# EAGLE design SRD (EAGLE 6.3)

## Sheet 1 of 5: Power Supply
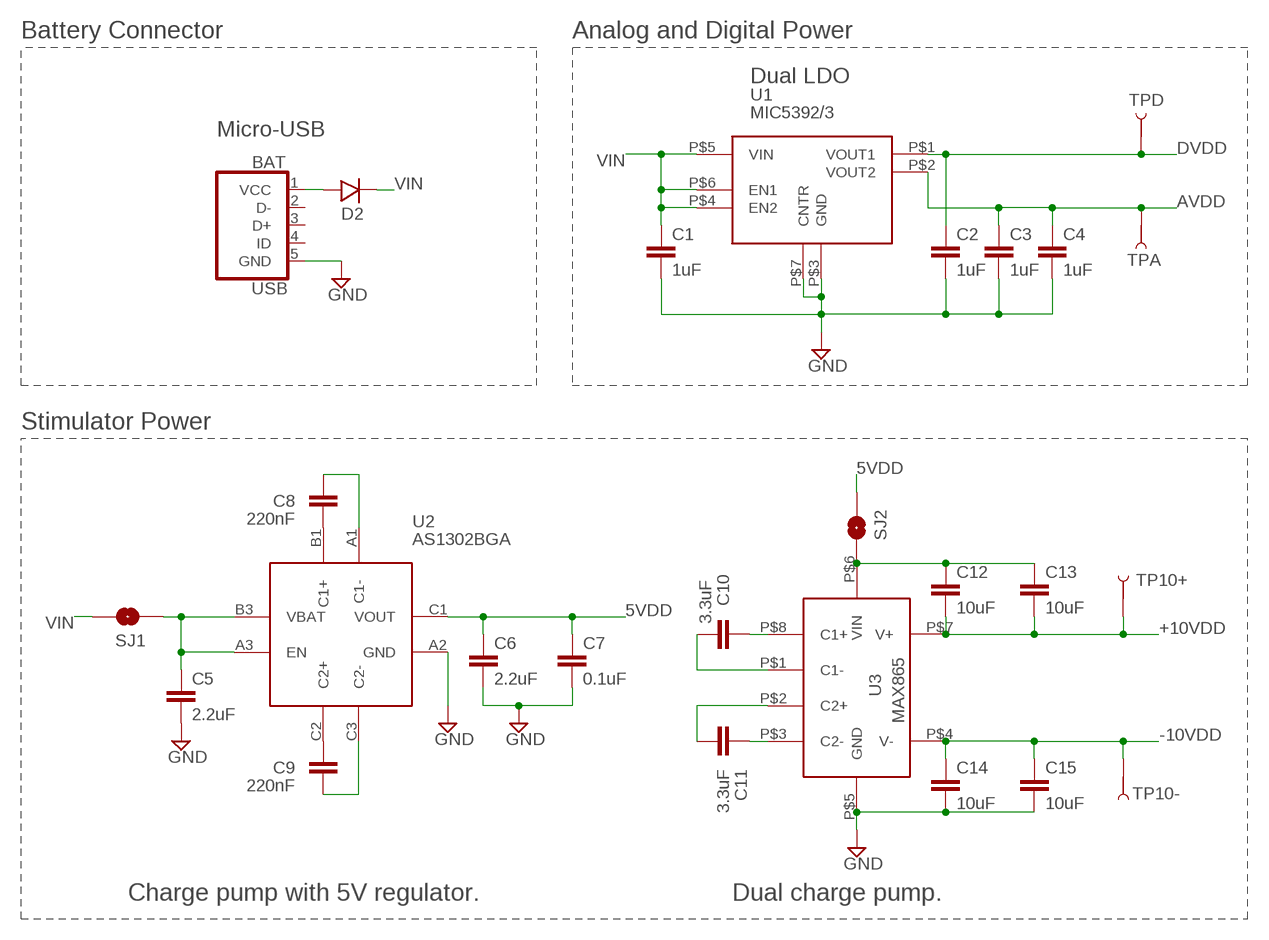
[diagram p0: schematic, sheet 1]

### Parts
BAT  USB  [USB-MICRO-B-TH]
C1  1uF  CC0603-N  [CAPC1608X90N]
C2  1uF  CC0603-N  [CAPC1608X90N]
C3  1uF  CC0603-N  [CAPC1608X90N]
C4  1uF  CC0603-N  [CAPC1608X90N]
C5  2.2uF  CC0603-N  [CAPC1608X90N]
C6  2.2uF  CC0603-N  [CAPC1608X90N]
C7  0.1uF  CC0603-N  [CAPC1608X90N]
C8  220nF  CC0402-N  [CAPC1005X55N]
C9  220nF  CC0402-N  [CAPC1005X55N]
C10  3.3uF  CC0805-N  [CAPC2012X100N]
C11  3.3uF  CC0805-N  [CAPC2012X100N]
C12  10uF  CC0805-N  [CAPC2012X100N]
C13  10uF  CC0805-N  [CAPC2012X100N]
C14  10uF  CC0805-N  [CAPC2012X100N]
C15  10uF  CC0805-N  [CAPC2012X100N]
D2  DIODE  [DO-216AA]
SJ1  SOLDERJUMPERNO  [SJ_2S-NO]
SJ2  SOLDERJUMPERNO  [SJ_2S-NO]
TP10+  TEST-POINT  [PAD1MMX1MM]
TP10-  TEST-POINT  [PAD1MMX1MM]
TPA  TEST-POINT  [PAD1MMX1MM]
TPD  TEST-POINT  [PAD1MMX1MM]
U1  MIC5392/3  [THIN_DFN]
U2  AS1302BGA  [BGA9C40P3X3_121X121X63B27N]
U3  MAX865  [UMAX8]

### Nets
5VDD: C6.1 C7.1 SJ2.1 U2.C1(VOUT)
+10VDD: C12.2 C13.2 TP10+.P$1 U3.P$7(V+) ; also sheet 5
-10VDD: C14.1 C15.1 TP10-.P$1 U3.P$4(V-) ; also sheet 5
AVDD: C3.1 C4.1 TPA.P$1 U1.P$2(VOUT2) ; also sheet 4
DVDD: C2.1 TPD.P$1 U1.P$1(VOUT1) ; also sheet 2,3,5
GND: BAT.5(GND) C1.2 C2.2 C3.2 C4.2 C5.2 C6.2 C7.2 C14.2 C15.2 U1.P$3(GND) U1.P$7(CNTR) U2.A2(GND) U3.P$5(GND) ; also sheet 2,3,4,5
N$4: C5.1 SJ1.1 U2.A3(EN) U2.B3(VBAT)
N$13: C12.1 C13.1 SJ2.2 U3.P$6(VIN)
N$33: C8.1 U2.A1(C1-)
N$36: C9.2 U2.C3(C2-)
N$42: C11.1 U3.P$3(C2-)
N$46: C11.2 U3.P$2(C2+)
N$47: C10.1 U3.P$8(C1+)
N$48: C10.2 U3.P$1(C1-)
N$49: C8.2 U2.B1(C1+)
N$50: C9.1 U2.C2(C2+)
VBAT: BAT.1(VCC) D2.A
VIN: C1.1 D2.C SJ1.2 U1.P$4(EN2) U1.P$5(VIN) U1.P$6(EN1)
Unconnected: BAT.2(D-) BAT.3(D+) BAT.4(ID)

### Notes on the sheet
- Battery Connector | Analog and Digital Power
- Dual LDO
- Micro-USB
- Stimulator Power
- Charge pump with 5V regulator. | Dual charge pump.

## Sheet 2 of 5: Main
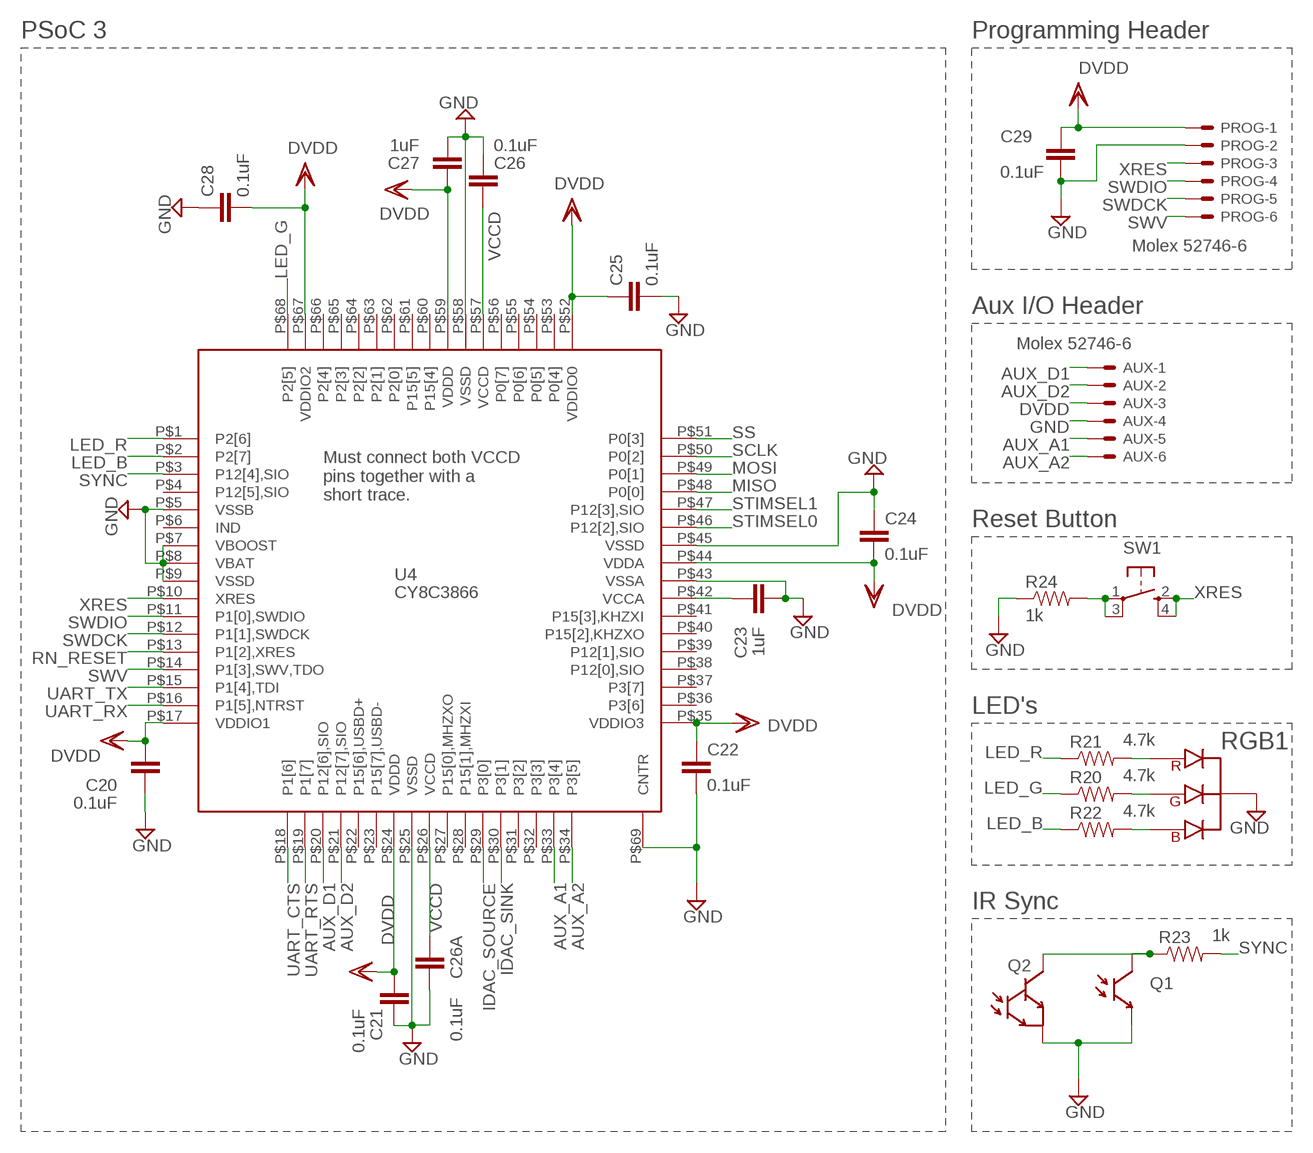
[diagram p1: schematic, sheet 2]

### Parts
AUX  52746-6  [52746-6]
C20  0.1uF  CC0402-N  [CAPC1005X55N]
C21  0.1uF  CC0402-N  [CAPC1005X55N]
C22  0.1uF  CC0402-N  [CAPC1005X55N]
C23  1uF  CC0402-N  [CAPC1005X55N]
C24  0.1uF  CC0402-N  [CAPC1005X55N]
C25  0.1uF  CC0402-N  [CAPC1005X55N]
C26  0.1uF  CC0402-N  [CAPC1005X55N]
C26A  0.1uF  CC0402-N  [CAPC1005X55N]
C27  1uF  CC0402-N  [CAPC1005X55N]
C28  0.1uF  CC0402-N  [CAPC1005X55N]
C29  0.1uF  CC0402-N  [CAPC1005X55N]
PROG  52746-6  [52746-6]
Q1  PHOTOTRANSISTOR  [MTD8000M3B-T]
Q2  PHOTOTRANSISTOR_D  [OP501]
R20  4.7k  RR0402-N  [RESC1005X35N]
R21  4.7k  RR0402-N  [RESC1005X35N]
R22  4.7k  RR0402-N  [RESC1005X35N]
R23  1k  RR0402-N  [RESC1005X35N]
R24  1k  RR0402-N  [RESC1005X35N]
RGB1  LED_RGB  [LED_RGB]
SW1  SPST_TACT-KMR2  [KMR2]
U4  CY8C3866  [QFN68_8MM_0.4PITCH]

### Nets
AUX_A1: AUX.5 U4.P$33(P3[4])
AUX_A2: AUX.6 U4.P$34(P3[5])
AUX_D1: AUX.1 U4.P$20(P12[6],SIO)
AUX_D2: AUX.2 U4.P$21(P12[7],SIO)
DVDD: AUX.3 C20.1 C21.1 C22.1 C24.2 C25.1 C27.1 C28.2 C29.1 PROG.1 U4.P$17(VDDIO1) U4.P$24(VDDD) U4.P$35(VDDIO3) U4.P$44(VDDA) U4.P$52(VDDIO0) U4.P$59(VDDD) U4.P$67(VDDIO2) ; supply symbol labelled VDD ; also sheet 1,3,5
GND: AUX.4 C20.2 C21.2 C22.2 C23.2 C24.1 C25.2 C26.2 C26A.1 C27.2 C28.1 C29.2 PROG.2 Q1.E Q2.E R24.1 RGB1.P$1(COM) U4.P$5(VSSB) U4.P$7(VBOOST) U4.P$8(VBAT) U4.P$9(VSSD) U4.P$25(VSSD) U4.P$43(VSSA) U4.P$45(VSSD) U4.P$58(VSSD) U4.P$69(CNTR) ; also sheet 1,3,4,5
IDAC_SINK: U4.P$30(P3[1]) ; also sheet 5
IDAC_SOURCE: U4.P$29(P3[0]) ; also sheet 5
LED_B: R22.1 U4.P$2(P2[7])
LED_G: R20.1 U4.P$68(P2[5])
LED_R: R21.1 U4.P$1(P2[6])
MISO: U4.P$48(P0[0]) ; also sheet 4
MOSI: U4.P$49(P0[1]) ; also sheet 4
N$3: R21.2 RGB1.P$2(R)
N$5: R20.2 RGB1.P$3(G)
N$7: R22.2 RGB1.P$4(B)
N$10: Q1.C Q2.C R23.1
N$12: R24.2 SW1.1(P) SW1.3(P1)
N$30: C23.1 U4.P$42(VCCA)
RN_RESET: U4.P$13(P1[2],XRES) ; also sheet 3
SCLK: U4.P$50(P0[2]) ; also sheet 4
SS: U4.P$51(P0[3]) ; also sheet 4
STIMSEL0: U4.P$46(P12[2],SIO) ; also sheet 5
STIMSEL1: U4.P$47(P12[3],SIO) ; also sheet 5
SWDCK: PROG.5 U4.P$12(P1[1],SWDCK)
SWDIO: PROG.4 U4.P$11(P1[0],SWDIO)
SWV: PROG.6 U4.P$14(P1[3],SWV,TDO)
SYNC: R23.2 U4.P$3(P12[4],SIO)
UART_CTS: U4.P$18(P1[6]) ; also sheet 3
UART_RTS: U4.P$19(P1[7]) ; also sheet 3
UART_RX: U4.P$16(P1[5],NTRST) ; also sheet 3
UART_TX: U4.P$15(P1[4],TDI) ; also sheet 3
VCCD: C26.1 C26A.2 U4.P$26(VCCD) U4.P$57(VCCD)
XRES: PROG.3 SW1.2(S) SW1.4(S1) U4.P$10(XRES)
Unconnected: U4.P$4(P12[5],SIO) U4.P$6(IND) U4.P$22(P15[6],USBD+) U4.P$23(P15[7],USBD-) U4.P$27(P15[0],MHZXO) U4.P$28(P15[1],MHZXI) U4.P$31(P3[2]) U4.P$32(P3[3]) U4.P$36(P3[6]) U4.P$37(P3[7]) U4.P$38(P12[0],SIO) U4.P$39(P12[1],SIO) U4.P$40(P15[2],KHZXO) U4.P$41(P15[3],KHZXI) U4.P$53(P0[4]) U4.P$54(P0[5]) U4.P$55(P0[6]) U4.P$56(P0[7]) U4.P$60(P15[4]) U4.P$61(P15[5]) U4.P$62(P2[0]) U4.P$63(P2[1]) U4.P$64(P2[2]) U4.P$65(P2[3]) U4.P$66(P2[4])

### Notes on the sheet
- PSoC 3 | Programming Header
- Molex 52746-6
- Aux I/O Header
- Molex 52746-6
- Must connect both VCCD
  pins together with a
  short trace.
- Reset Button
- LED's
- IR Sync

## Sheet 3 of 5: Bluetooth
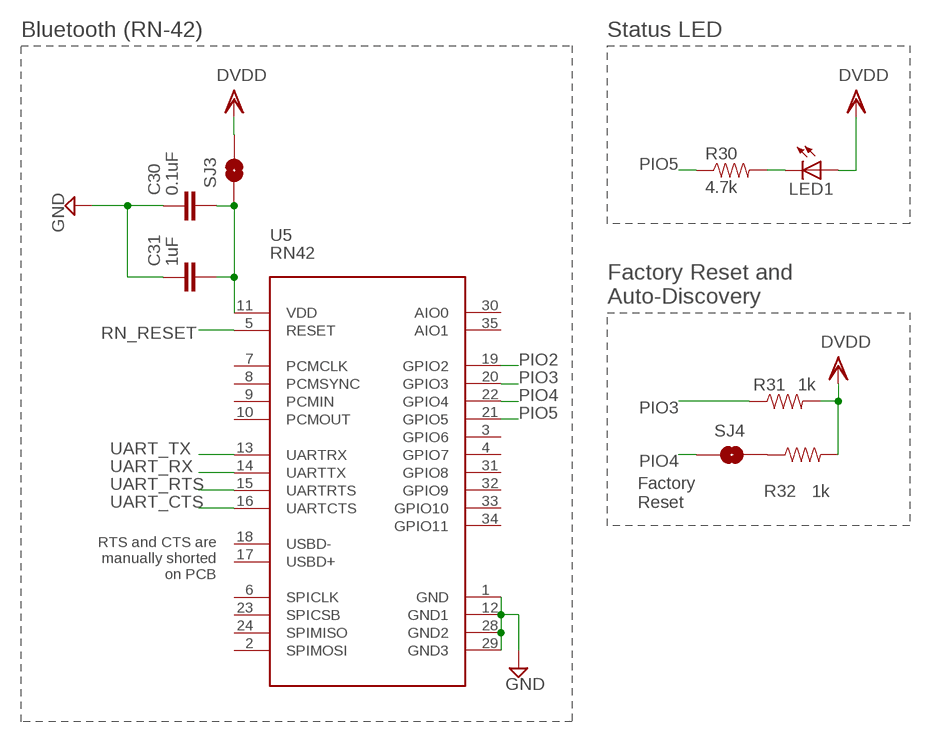
[diagram p2: schematic, sheet 3]

### Parts
C30  0.1uF  CC0603-N  [CAPC1608X90N]
C31  1uF  CC0805-N  [CAPC2012X100N]
LED1  LED  [CHIPLED_0603]
R30  4.7k  RR0402-N  [RESC1005X35N]
R31  1k  RR0402-N  [RESC1005X35N]
R32  1k  RR0402-N  [RESC1005X35N]
SJ3  SOLDERJUMPERNO  [SJ_2S-NO]
SJ4  SOLDERJUMPERNO  [SJ_2S-NO]
U5  RN42  [RN42]

### Nets
DVDD: LED1.A R31.2 R32.2 SJ3.2 ; supply symbol labelled VDD ; also sheet 1,2,5
GND: C30.1 C31.1 U5.1(GND) U5.12(GND1) U5.28(GND2) U5.29(GND3) ; also sheet 1,2,4,5
N$8: LED1.C R30.2
N$9: C30.2 C31.2 SJ3.1 U5.11(VDD)
N$16: R32.1 SJ4.2
PIO2: U5.19(GPIO2)
PIO3: R31.1 U5.20(GPIO3)
PIO4: SJ4.1 U5.22(GPIO4)
PIO5: R30.1 U5.21(GPIO5)
RN_RESET: U5.5(RESET) ; also sheet 2
UART_CTS: U5.16(UARTCTS) ; also sheet 2
UART_RTS: U5.15(UARTRTS) ; also sheet 2
UART_RX: U5.14(UARTTX) ; also sheet 2
UART_TX: U5.13(UARTRX) ; also sheet 2
Unconnected: U5.2(SPIMOSI) U5.3(GPIO6) U5.4(GPIO7) U5.6(SPICLK) U5.7(PCMCLK) U5.8(PCMSYNC) U5.9(PCMIN) U5.10(PCMOUT) U5.17(USBD+) U5.18(USBD-) U5.23(SPICSB) U5.24(SPIMISO) U5.30(AIO0) U5.31(GPIO8) U5.32(GPIO9) U5.33(GPIO10) U5.34(GPIO11) U5.35(AIO1)

### Notes on the sheet
- Bluetooth (RN-42) | Status LED
- Factory Reset and 
  Auto-Discovery
- Factory
  Reset
- RTS and CTS are
  manually shorted
  on PCB

## Sheet 4 of 5: ADC
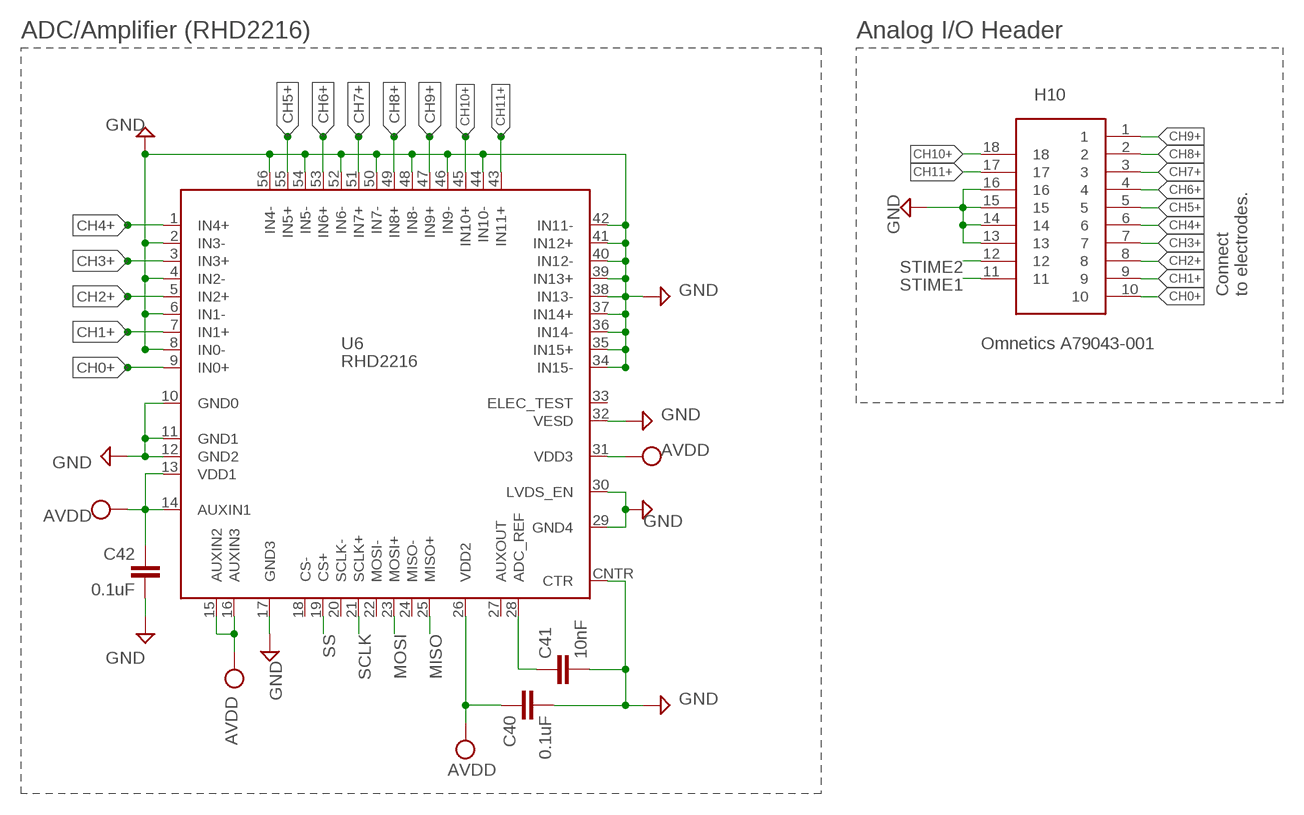
[diagram p3: schematic, sheet 4]

### Parts
C40  0.1uF  CC0402-N  [CAPC1005X55N]
C41  10nF  CC0402-N  [CAPC1005X55N]
C42  0.1uF  CC0402-N  [CAPC1005X55N]
H10  A79043-001  [OMNETCS-18PIN-SMD]
U6  RHD2216  [RHD2000]

### Nets
AVDD: C40.1 C42.1 U6.13(VDD1) U6.14(AUXIN1) U6.15(AUXIN2) U6.16(AUXIN3) U6.26(VDD2) U6.31(VDD3) ; supply symbol labelled VDD ; also sheet 1
CH0+: H10.10 U6.9(IN0+)
CH1+: H10.9 U6.7(IN1+)
CH2+: H10.8 U6.5(IN2+)
CH3+: H10.7 U6.3(IN3+)
CH4+: H10.6 U6.1(IN4+)
CH5+: H10.5 U6.55(IN5+)
CH6+: H10.4 U6.53(IN6+)
CH7+: H10.3 U6.51(IN7+)
CH8+: H10.2 U6.49(IN8+)
CH9+: H10.1 U6.47(IN9+)
CH10+: H10.18 U6.45(IN10+)
CH11+: H10.17 U6.43(IN11+)
GND: C40.2 C41.2 C42.2 H10.13 H10.14 H10.15 H10.16 U6.2(IN3-) U6.4(IN2-) U6.6(IN1-) U6.8(IN0-) U6.10(GND0) U6.11(GND1) U6.12(GND2) U6.17(GND3) U6.29(GND4) U6.30(LVDS_EN) U6.32(VESD) U6.34(IN15-) U6.35(IN15+) U6.36(IN14-) U6.37(IN14+) U6.38(IN13-) U6.39(IN13+) U6.40(IN12-) U6.41(IN12+) U6.42(IN11-) U6.44(IN10-) U6.46(IN9-) U6.48(IN8-) U6.50(IN7-) U6.52(IN6-) U6.54(IN5-) U6.56(IN4-) U6.CNTR(CTR) ; also sheet 1,2,3,5
MISO: U6.25(MISO+) ; also sheet 2
MOSI: U6.23(MOSI+) ; also sheet 2
N$2: C41.1 U6.28(ADC_REF)
SCLK: U6.21(SCLK+) ; also sheet 2
SS: U6.19(CS+) ; also sheet 2
STIME1: H10.11 ; also sheet 5
STIME2: H10.12 ; also sheet 5
Unconnected: U6.18(CS-) U6.20(SCLK-) U6.22(MOSI-) U6.24(MISO-) U6.27(AUXOUT) U6.33(ELEC_TEST)

### Notes on the sheet
- ADC/Amplifier (RHD2216) | Analog I/O Header
- Connect
  to electrodes.
- Omnetics A79043-001

## Sheet 5 of 5: Stimulator
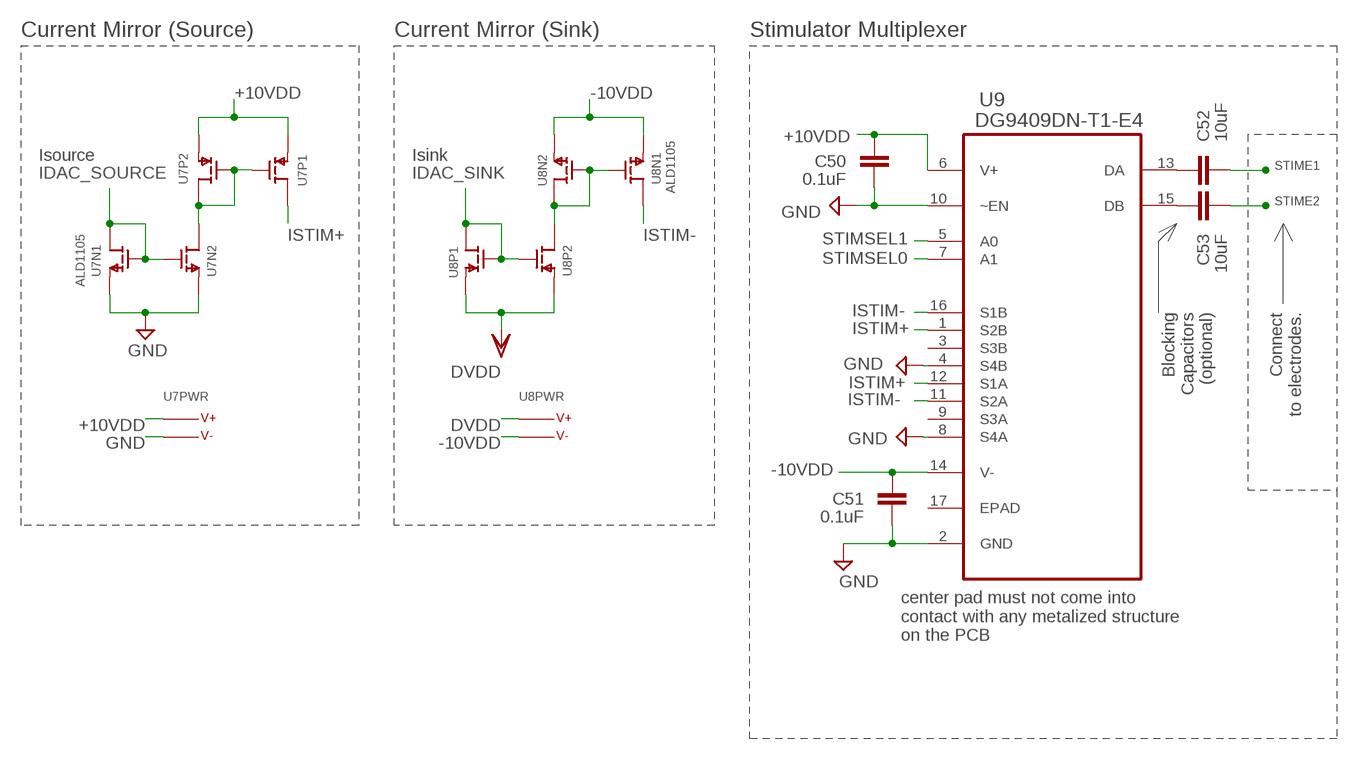
[diagram p4: schematic, sheet 5]

### Parts
C50  0.1uF  CC0603-N  [CAPC1608X90N]
C51  0.1uF  CC0603-N  [CAPC1608X90N]
C52  10uF  CC0805-N  [CAPC2012X100N]
C53  10uF  CC0805-N  [CAPC2012X100N]
U7  ALD1105  [SO14MIN]
U8  ALD1105  [SO14MIN]
U9  DG9409DN-T1-E4  [QFN65P400X400X100-17N]

### Nets
+10VDD: C50.1 U7.7(P1:S) U7.8(P2:S) U7.11(PWR:V+) U9.6(V+) ; also sheet 1
-10VDD: C51.1 U8.3(N1:S) U8.4(PWR:V-) U8.12(N2:S) U9.14(V-) ; also sheet 1
DVDD: U8.7(P1:S) U8.8(P2:S) U8.11(PWR:V+) ; supply symbol labelled VDD ; also sheet 1,2,3
GND: C50.2 C51.2 U7.3(N1:S) U7.4(PWR:V-) U7.12(N2:S) U9.2(GND) U9.4(S4B) U9.8(S4A) U9.10(~EN) ; also sheet 1,2,3,4
IDAC_SINK: U8.5(P1:D) U8.6(P1:G) U8.9(P2:G) ; also sheet 2
IDAC_SOURCE: U7.1(N1:D) U7.2(N1:G) U7.13(N2:G) ; also sheet 2
ISTIM+: U7.5(P1:D) U9.1(S2B) U9.12(S1A)
ISTIM-: U8.1(N1:D) U9.11(S2A) U9.16(S1B)
N$6: C52.1 U9.13(DA)
N$11: U7.6(P1:G) U7.9(P2:G) U7.10(P2:D) U7.14(N2:D)
N$17: C53.1 U9.15(DB)
N$31: U8.2(N1:G) U8.10(P2:D) U8.13(N2:G) U8.14(N2:D)
STIME1: C52.2 ; also sheet 4
STIME2: C53.2 ; also sheet 4
STIMSEL0: U9.7(A1) ; also sheet 2
STIMSEL1: U9.5(A0) ; also sheet 2
Unconnected: U9.3(S3B) U9.9(S3A) U9.17(EPAD)

### Notes on the sheet
- Current Mirror (Source) | Current Mirror (Sink) | Stimulator Multiplexer
- Isource | Isink
- Blocking
  Capacitors
  (optional)
- Connect
  to electrodes.
- center pad must not come into
  contact with any metalized structure
  on the PCB

## Library data of the parts
AUX PROG = con-molex:52746-6: FPC Connector ZIF for SMT 0.5mm Source: http://www.farnell.com/datasheets/73044.pdf [DWG. NO. (Sheet 1 OF 2) SD-52746-**17]; OC_FARNELL: unknown; OC_NEWARK: unknown
BAT = Ramshur:USB: USB Micro-B Plug Comes in a variety of packages. Check out Hirose's ZX-x0 line: http://www.hirose.co.jp/cataloge_hp/e24200011.pdf
C1-C15 C20-C26 C26A C27-C31 C40-C42 C50-C53 = Ramshur:C: Capacitor (english/metric) cermaic capacitor nominal landpattern (N).
D2 = Ramshur:DIODE: Diode
H10 = Ramshur:A79043-001: Omnetics 18 Position Dual Row Female Nano-Miniature (.025"/.64mm) Connector. Featuring 2 Guide Posts Holes and Vertical Surface Mount Tails.
LED1 = Ramshur:LED: LED OSRAM: - CHIPLED LG R971, LG N971, LY N971, LG Q971, LY Q971, LO R971, LY R971 LH N974, LH R974 LS Q976, LO Q976, LY Q976 LO Q996 - Hyper CHIPLED LW Q18S LB Q993, LB Q99A, LB R99A - SideLED LS A670, LO A670, LY A670, LG A670, LP A670 LB A673, LV A673, LT A673, LW A673 LH A674 LY A675 LS A676, LA A676, LO A676, LY A676, LW A676 LS A679, LY A679, LG A679 - Hyper Micro SIDELED® LS Y876, LA Y876, LO Y876, LY Y876 LT Y87S - SmartLED LW L88C, LW L88S LB L89C, LB L89S, LG L890 LS L89K, LO L89K, LY L89K LS L896, LA L896, LO L896, LY L896 - TOPLED LS T670, LO T670, LY T670, LG T670, LP T670 LSG T670, LSP T670, LSY T670, LOP T670, LYG T670 LG T671, LOG T671, LSG T671 LB T673, LV T673, LT T673, LW T673 LH T674 LS T676, LA T676, LO T676, LY T676, LB T676, LH T676, LSB T676, LW T676 LB T67C, LV T67C, LT T67C, LS T67K, LO T67K, LY T67K, LW E67C LS E67B, LA E67B, LO E67B, LY E67B, LB E67C, LV E67C, LT E67C LW T67C LS T679, LY T679, LG T679 LS T770, LO T770, LY T770, LG T770, LP T770 LB T773, LV T773, LT T773, LW T773 LH T774 LS E675, LA E675, LY E675, LS T675 LS T776, LA T776, LO T776, LY T776, LB T776 LHGB T686 LT T68C, LB T68C - Hyper Mini TOPLED® LB M676 - Mini TOPLED Santana® LG M470 LS M47K, LO M47K, LY M47K Source: http://www.osram.convergy.de/
Q1 = Ramshur:PHOTOTRANSISTOR: phototransistor
Q2 = Ramshur:PHOTOTRANSISTOR_D
R20-R24 R30-R32 = Ramshur:R: Resistor Basic schematic elements and footprints for 0603, 1206, and PTH resistors.
RGB1 = Ramshur:LED_RGB: Kignbright APTF1616SEJ3ZGGVBDC
SJ1-SJ4 = Ramshur:SOLDERJUMPER: Solder Jumper Standard SMD solder jumper. Used to automate production. Two varients : Normally Open and Normally Closed are the same, but have different paste layers. NC will have a large amount of paste and should jumper during reflow.
SW1 = _adafruit:SPST_TACT: SMT 6mm switch, EVQQ2 series http://www.ladyada.net/library/eagle
TP10+ TP10- TPA TPD = Ramshur:TEST-POINT: Bare copper test points for troubleshooting or ICT
U1 = Ramshur:MIC5392/3: Micrel High-Performance Dual 150mA LDO
U2 = Ramshur:AS1302
U3 = _ramshur:MAX865
U4 = Ramshur:CY8C3866
U5 = Ramshur:RN42: Microchip (Roving Networks) RN42 Bluetooth module with antena.
U6 = Ramshur:RHD2216
U7 U8 = Ramshur:ALD1105
U9 = DG9409:DG9409DN-T1-E4: Analog Multiplexers; MPN: DG9409DN-T1-E4; OC_FARNELL: -; OC_NEWARK: 65K2483; PACKAGE: QFN-16; SUPPLIER: VISHAY SILICONIX

## Board
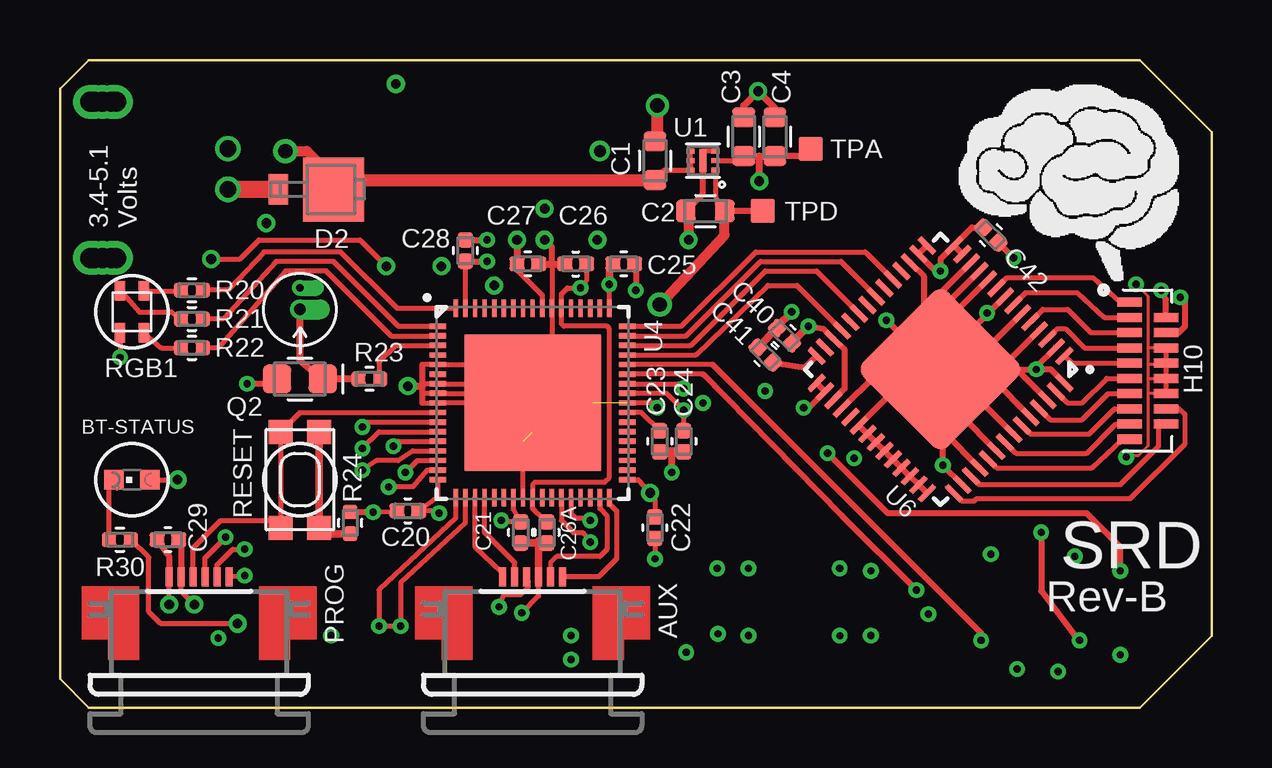
[diagram p5: board, top side]
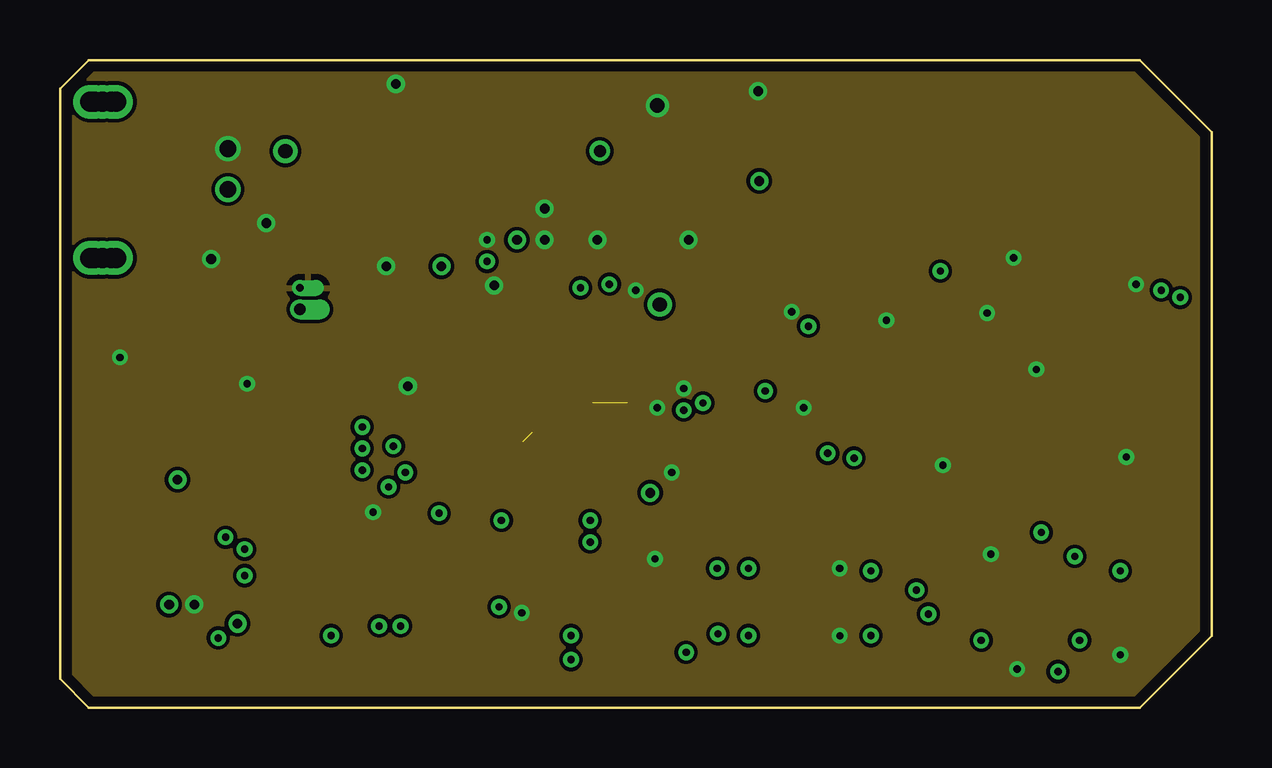
[diagram p6: board, inner layer Route2]
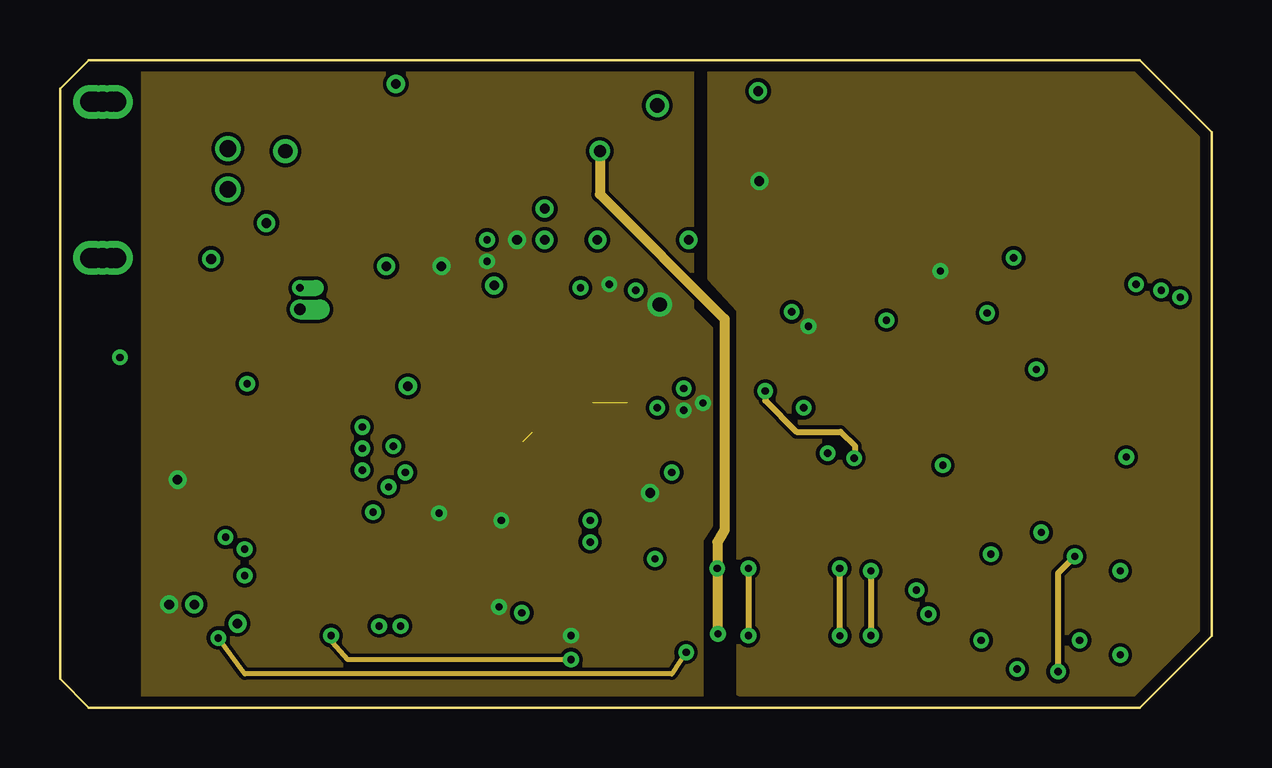
[diagram p7: board, inner layer Route15]
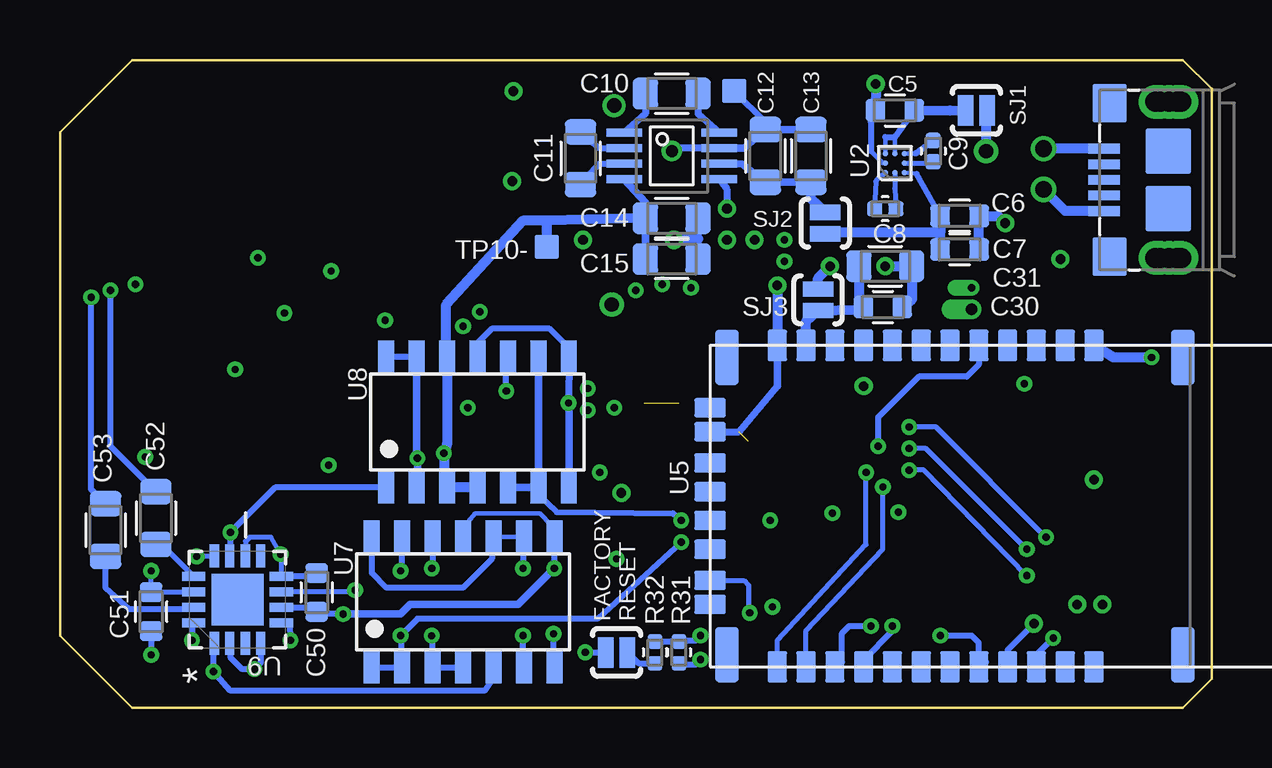
[diagram p8: board, bottom side, seen from below]

Size 48 x 27 mm. Coordinates in mm from the lower left corner, seen from the top.
Outline: 1.2,0 45,0 48,3 48,24 45,27 1.2,27 0,25.8 0,1.2 1.2,0
Copper layers ((1*2)+(15*16)): Top 0.0356mm / dielectric 1.5011mm / Route2 0.0356mm / dielectric 0.1499mm / Route15 0.0356mm / dielectric 0.2007mm / Bottom 0.0356mm
Design rules "LaenPCBOrder_johnmod": minimum track width 5mil, minimum drill 10mil, track to track 6mil, track to pad 6mil, pad to pad 6mil, via to via 6mil, smd to smd 6mil, copper to edge 17mil, drill to drill 6mil, minimum pad ring 7mil, minimum via ring 7mil, stop-mask expansion 0.04mm, vias tented up to drill 0.8mm, thermal gap 10mil

### Footprints (pad centres in the part's own frame; a part is rotated, then mirrored left to right if it is on the bottom)
52746-6 = smd 0.3 x 0.8: 1 -1.25,2.35; 2 -0.75,2.35; 3 -0.25,2.35; 4 0.25,2.35; 5 0.75,2.35; 6 1.25,2.35
USB-MICRO-B-TH = smd 0.4 x 1.35: 1 -1.3,2.675; 2 -0.65,2.675; 3 0,2.675; 4 0.65,2.675; 5 1.3,2.675 | drill 0.84 pad 1.4: P$1 -3.255,-0.36; P$2 -3.255,-0.03; P$3 -3.255,0.54; P$4 -3.255,-0.54; P$5 -3.255,0.34; P$6 3.255,0.54; P$7 3.255,-0.54; P$8 3.255,-0.36; P$9 3.255,-0.03; P$10 3.255,0.34 | smd 1.6 x 1.4: PAD1 -3.2,2.45; PAD2 3.2,2.45 | smd 1.9 x 1.9: TH1 -1.2,0; TH2 1.2,0
CAPC1608X90N = smd 0.81 x 0.93: 1 -0.81,0; 2 0.81,0
CAPC1005X55N = smd 0.64 x 0.63: 1 -0.445,0; 2 0.445,0
CAPC2012X100N = smd 1.05 x 1.3: 1 -1.1,0; 2 1.1,0
DO-216AA = smd 0.8 x 1.27: A 0.7,0 | smd 2.54 x 2.67: C -1.6,0
OMNETCS-18PIN-SMD = smd 1.016 x 0.381: 1 1.524,5.715; 2 1.524,5.08; 3 1.524,4.445; 4 1.524,3.81; 5 1.524,3.175; 6 1.524,2.54; 7 1.524,1.905; 8 1.524,1.27; 9 1.524,0.635; 10 1.524,0; 11 0,0.635; 12 0,1.27; 13 0,1.905; 14 0,2.54; 15 0,3.175; 16 0,3.81; 17 0,4.445; 18 0,5.08
CHIPLED_0603 = smd 0.8 x 0.8: A 0,-0.75; C 0,0.75
MTD8000M3B-T = drill 0.47 pad 0.78 offset: C 0,0 | drill 0.32 pad 0.63 offset: E -0.9,0
OP501 = smd 1.2 x 1.2: C -0.955,0; E 0.955,0
RESC1005X35N = smd 0.59 x 0.6: 1 -0.455,0; 2 0.455,0
LED_RGB = smd 0.8 x 0.5: P$1 0.875,-0.5; P$2 -0.875,-0.5; P$3 -0.875,0.5; P$4 0.875,0.5
SJ_2S-NO = smd 0.635 x 1.27: 1 -0.45,0; 2 0.45,0
KMR2 = smd 1 x 1: 1 2,0.8; 2 2,-0.8; 3 -2,0.8; 4 -2,-0.8
PAD1MMX1MM = smd 1 x 1: P$1 0,0
THIN_DFN = smd 0.35 x 0.18: P$1 -0.525,0.4; P$2 -0.525,0; P$3 -0.525,-0.4; P$4 0.525,-0.4; P$5 0.525,0; P$6 0.525,0.4 | smd 0.3 x 0.94: P$7 0,0
BGA9C40P3X3_121X121X63B27N = smd 0.22 x 0.22: A1 -0.4,-0.4; A2 -0.4,0; A3 -0.4,0.4; B1 0,-0.4; B3 0,0.4; C1 0.4,-0.4; C2 0.4,0; C3 0.4,0.4
UMAX8 = smd 1.5 x 0.3: P$1 -1.98,0.975; P$2 -1.98,0.325; P$3 -1.98,-0.325; P$4 -1.98,-0.975; P$5 1.98,-0.975; P$6 1.98,-0.325; P$7 1.98,0.325; P$8 1.98,0.975
QFN68_8MM_0.4PITCH = smd 0.7 x 0.2: P$1 -3.95,3.2; P$2 -3.95,2.8; P$3 -3.95,2.4; P$4 -3.95,2; P$5 -3.95,1.6; P$6 -3.95,1.2; P$7 -3.95,0.8; P$8 -3.95,0.4; P$9 -3.95,0; P$10 -3.95,-0.4; P$11 -3.95,-0.8; P$12 -3.95,-1.2; P$13 -3.95,-1.6; P$14 -3.95,-2; P$15 -3.95,-2.4; P$16 -3.95,-2.8; P$17 -3.95,-3.2; P$35 3.95,-3.2; P$36 3.95,-2.8; P$37 3.95,-2.4; P$38 3.95,-2; P$39 3.95,-1.6; P$40 3.95,-1.2; P$41 3.95,-0.8; P$42 3.95,-0.4; P$43 3.95,0; P$44 3.95,0.4; P$45 3.95,0.8; P$46 3.95,1.2; P$47 3.95,1.6; P$48 3.95,2; P$49 3.95,2.4; P$50 3.95,2.8; P$51 3.95,3.2 | smd 0.2 x 0.7: P$18 -3.2,-3.95; P$19 -2.8,-3.95; P$20 -2.4,-3.95; P$21 -2,-3.95; P$22 -1.6,-3.95; P$23 -1.2,-3.95; P$24 -0.8,-3.95; P$25 -0.4,-3.95; P$26 0,-3.95; P$27 0.4,-3.95; P$28 0.8,-3.95; P$29 1.2,-3.95; P$30 1.6,-3.95; P$31 2,-3.95; P$32 2.4,-3.95; P$33 2.8,-3.95; P$34 3.2,-3.95; P$52 3.2,3.95; P$53 2.8,3.95; P$54 2.4,3.95; P$55 2,3.95; P$56 1.6,3.95; P$57 1.2,3.95; P$58 0.8,3.95; P$59 0.4,3.95; P$60 0,3.95; P$61 -0.4,3.95; P$62 -0.8,3.95; P$63 -1.2,3.95; P$64 -1.6,3.95; P$65 -2,3.95; P$66 -2.4,3.95; P$67 -2.8,3.95; P$68 -3.2,3.95 | smd 5.7 x 5.7: P$69 0,0
RN42 = smd 1.3 x 0.8: 1 -6.7,3.1; 2 -6.7,1.9; 3 -6.7,0.7; 4 -6.7,-0.5; 5 -6.7,-1.7; 6 -6.7,-2.9; 7 -6.7,-4.1; 8 -6.7,-5.3; 9 -6.7,-6.5; 10 -6.7,-7.7; 11 -6.7,-8.9; 12 -6.7,-10.1; 13 6.7,-10.1; 14 6.7,-8.9; 15 6.7,-7.7; 16 6.7,-6.5; 17 6.7,-5.3; 18 6.7,-4.1; 19 6.7,-2.9; 20 6.7,-1.7; 21 6.7,-0.5; 22 6.7,0.7; 23 6.7,1.9; 24 6.7,3.1 | smd 0.8 x 1.3: 28 3.1,-12.9; 29 -3.1,-12.9; 30 4.1,-12.9; 31 1.8,-12.9; 32 0.6,-12.9; 33 -0.6,-12.9; 34 -1.8,-12.9; 35 -4.1,-12.9 | smd 2.3 x 1: SH1 -6.2,6.8; SH2 -6.2,-12.2; SH3 6.2,-12.2; SH4 6.2,6.8
RHD2000 = smd 0.9 x 0.25: 1 -4.05,3.25; 2 -4.05,2.75; 3 -4.05,2.25; 4 -4.05,1.75; 5 -4.05,1.25; 6 -4.05,0.75; 7 -4.05,0.25; 8 -4.05,-0.25; 9 -4.05,-0.75; 10 -4.05,-1.25; 11 -4.05,-1.75; 12 -4.05,-2.25; 13 -4.05,-2.75; 14 -4.05,-3.25; 29 4.05,-3.25; 30 4.05,-2.75; 31 4.05,-2.25; 32 4.05,-1.75; 33 4.05,-1.25; 34 4.05,-0.75; 35 4.05,-0.25; 36 4.05,0.25; 37 4.05,0.75; 38 4.05,1.25; 39 4.05,1.75; 40 4.05,2.25; 41 4.05,2.75; 42 4.05,3.25 | smd 0.25 x 0.9: 15 -3.25,-4.05; 16 -2.75,-4.05; 17 -2.25,-4.05; 18 -1.75,-4.05; 19 -1.25,-4.05; 20 -0.75,-4.05; 21 -0.25,-4.05; 22 0.25,-4.05; 23 0.75,-4.05; 24 1.25,-4.05; 25 1.75,-4.05; 26 2.25,-4.05; 27 2.75,-4.05; 28 3.25,-4.05; 43 3.25,4.05; 44 2.75,4.05; 45 2.25,4.05; 46 1.75,4.05; 47 1.25,4.05; 48 0.75,4.05; 49 0.25,4.05; 50 -0.25,4.05; 51 -0.75,4.05; 52 -1.25,4.05; 53 -1.75,4.05; 54 -2.25,4.05; 55 -2.75,4.05; 56 -3.25,4.05 | smd 5 x 5: CNTR 0,0
SO14MIN = smd 1.35 x 0.66: 1 -2.723,3.809; 2 -2.723,2.539; 3 -2.723,1.269; 4 -2.723,-0.001; 5 -2.723,-1.271; 6 -2.723,-2.541; 7 -2.723,-3.811; 8 2.723,-3.811; 9 2.723,-2.541; 10 2.723,-1.271; 11 2.723,-0.001; 12 2.723,1.269; 13 2.723,2.539; 14 2.723,3.809
QFN65P400X400X100-17N = smd 0.965 x 0.381: 1 -1.829,0.965; 2 -1.829,0.33; 3 -1.829,-0.33; 4 -1.829,-0.965; 9 1.829,-0.965; 10 1.829,-0.33; 11 1.829,0.33; 12 1.829,0.965 | smd 0.381 x 0.965: 5 -0.965,-1.829; 6 -0.33,-1.829; 7 0.33,-1.829; 8 0.965,-1.829; 13 0.965,1.829; 14 0.33,1.829; 15 -0.33,1.829; 16 -0.965,1.829 | smd 2.159 x 2.159: 17 0,0

### Placement (x,y rotation side)
AUX  19.7,3.1 0 top
BAT  1.8,22 90 bottom
C1  24.8,22.8 90 top
C2  26.9,20.7 180 top
C3  28.5,23.8 90 top
C4  29.8,23.8 90 top
C5  13.2,24.9 180 bottom
C6  10.5,20.5 0 bottom
C7  10.5,19.1 0 bottom
C8  13.6,20.8 0 bottom
C9  11.6,23.2 90 bottom
C10  22.5,25.6 180 bottom
C11  26.3,22.9 90 bottom
C12  18.6,23 90 bottom
C13  16.7,23 90 bottom
C14  22.5,20.4 0 bottom
C15  22.5,18.7 0 bottom
C20  14.5,8.2 180 top
C21  19.2,7.3 270 top
C22  24.8,7.5 270 top
C23  25,11.1 270 top
C24  26,11.1 90 top
C25  23.5,18.5 0 top
C26  21.5,18.5 180 top
C26A  20.3,7.3 90 top
C27  19.5,18.5 0 top
C28  16.9,19.05 270 top
C29  4.5,7 0 top
C30  13.7,16.7 180 bottom
C31  13.6,18.4 180 bottom
C40  30.2,15.5 135 top
C41  29.4,14.7 135 top
C42  38.8,19.7 315 top
C50  37.3,4.8 90 bottom
C51  44.2,4 270 bottom
C52  44,7.9 90 bottom
C53  46.1,7.4 90 bottom
D2  9.8,21.6 180 top
H10  46.1,16.9 180 top
LED1  3,9.5 90 top
PROG  5.8,3.1 0 top
Q1  10,16.6 270 top
Q2  10,13.7 180 top
R20  5.5,17.4 180 top
R21  5.5,16.2 180 top
R22  5.5,15 180 top
R23  12.9,13.7 0 top
R24  12.1,7.7 270 top
R30  2.5,7 180 top
R31  22.2,2.3 90 bottom
R32  23.2,2.3 90 bottom
RGB1  3,16.5 270 top
SJ1  9.8,24.9 0 bottom
SJ2  16.1,20.2 90 bottom
SJ3  16.4,17 90 bottom
SJ4  24.8,2.3 0 bottom
SW1  10,9.5 270 top
TP10+  19.9,25.7 90 bottom
TP10-  27.7,19.2 0 bottom
TPA  31.3,23.3 0 top
TPD  29.3,20.7 0 top
U1  26.8,22.8 180 top
U2  13.2,22.7 0 bottom
U3  22.5,23 0 bottom
U4  19.7,12.7 0 top
U5  8,8.4 270 bottom
U6  36.7,14.1 225 top
U7  31.2,4.4 90 bottom
U8  30.6,11.9 90 bottom
U9  40.6,4.5 90 bottom
U$1  [LOGO_BRAIN]  37.5,17.8 0 top

### Tracks (layer width: path | path; a pad name or v marks a point on that pad's centre or on a via)
5VDD
  Bottom 0.178: 12.3,22.26 U2.C1
  Bottom 0.254: C6.1 12.3,22.26
  Bottom 0.406: 11.31,19.8 16.09,19.8 SJ2.1 | C6.1 11.31,19.8 | C7.1 11.31,19.8
+10VDD  (via drill 0.3, 0.5)
  Route15 0.406: v22.5,23.2 22.5,21.4 27.7,16.2 27.7,7.4 27.4,6.9 v27.4,5.8 27.4,3.1 v27.43,3.08
  Bottom 0.178: U7.8 27.52,7.62 28,8.1 30.7,8.1 31.2,7.5 31.2,7.44 U7.11 | 27.43,5.83 v27.4,5.8
  Bottom 0.254: U9.6 37.48,4.17 C50.1 | 37.29,3.8 C50.1 | v36.2,3.9 37.21,3.9 C50.1 | U7.8 v27.4,5.8 | U7.7 27.43,1.68 v27.43,3.08 | TP10+.P$1 18.6,24.4 C12.2
  Bottom 0.3: U3.P$7 22.27,23.32 v22.5,23.2 | 19.48,23.32 C12.2
  Bottom 0.305: 19.48,23.32 U3.P$7 | v36.2,3.9 33.8,3.9 33.4,4.3 28.9,4.3 v27.4,5.8 | C13.2 C12.2
-10VDD  (via drill 0.3)
  Top 0.254: v44.2,5.7 44.2,6.7 42.8,8.1 34.5,8.1 v32,10.6
  Bottom 0.2: v44.2,5.7 C51.1 43.92,4.83 U9.14
  Bottom 0.254: U8.12 31.9,14.67 | U9.14 42.49,4.89
  Bottom 0.305: C15.1 C14.1 23.6,21.05 U3.P$4
  Bottom 0.406: 31.9,14.67 31.9,16.8 28.7,20.3 27.7,20.3 | U8.12 31.87,10.97 v32,10.6 32,9.25 U8.3 U8.4 | C14.1 27.7,20.3 | TP10-.P$1 27.7,20.3
AUX_A1
  Top 0.178: 20.7,6.3 20.45,6.05 AUX.5
  Top 0.2: U4.P$33 22.5,8.3 22.8,8 22.8,6.6 22.5,6.3 20.7,6.3
AUX_A2
  Top 0.2: U4.P$34 22.9,8.5 23.2,8.2 23.2,6.2 22.45,5.45 AUX.6
AUX_D1
  Top 0.2: AUX.1 18.4,5.65 17.3,6.7 U4.P$20
AUX_D2
  Top 0.2: AUX.2 18.95,6.05 17.7,7.3 U4.P$21
AVDD  (via drill 0.3, 0.4)
  Top 0.2: U1.P$2 28.31,22.8 C3.1
  Top 0.254: TPA.P$1 31.21,22.99 C4.1 | U6.31 32.24,12.85 32.7,13.3 32.7,14.92 U6.26 31.82,15.8 v31.2,15.9 | U6.15 U6.16 36.59,18.1 v36.7,18.2 | U6.14 U6.13 | 36.8,18.1 v36.7,18.2 | U6.14 38.02,20.02 C42.1 | U6.14 36.7,18.7 v36.7,18.2
  Top 0.3: C3.1 29.15,22.99 | 29.15,22.99 C4.1 | v29.15,21.95 29.15,22.99
  Top 0.305: C40.1 30.52,15.21 v31.2,15.9
  pour Route15: 47.5,27.4 27.1,27.7 27.1,17.9 28.3,16.6 28.3,0.6 47.5,0.6
CH0+
  Top 0.2: H10.10 44.2,16.9 43.1,17.9 39.44,17.9 U6.9
CH1+
  Top 0.2: H10.9 43.53,16.27 42.4,17.3 40.25,17.3 U6.7
CH2+
  Top 0.2: H10.8 42.97,15.63 42,16.6 40.97,16.6 U6.5
CH3+
  Top 0.2: H10.7 42.7,14.99 41.9,15.8 41.58,15.8 U6.3
CH4+
  Top 0.2: H10.6 42.17,14.36 U6.1
CH5+
  Top 0.2: H10.5 43.62,13.72 42.6,12.7 41.99,12.7 U6.55
CH6+
  Top 0.2: H10.4 43.69,13.09 42.6,12 41.27,12 U6.53
CH7+
  Top 0.2: H10.3 43.95,12.46 42.9,11.4 40.46,11.4 U6.51
CH8+
  Top 0.2: H10.2 44.02,11.82 42.8,10.6 39.85,10.6 U6.49
CH9+
  Top 0.2: H10.1 44.28,11.19 43,10 39.03,10 U6.47
CH10+
  Top 0.2: H10.18 45.82,11.82 45.8,11.6 45.8,10.9 44.2,9.3 38.32,9.3 U6.45
CH11+
  Top 0.2: 37.5,8.7 U6.43 37.6,8.6 38.1,8.6 38.2,8.7 44.6,8.7 46.9,11 46.9,12.2 46.65,12.46 H10.17
DVDD  (via drill 0.3, 0.4, 0.6 pad 1.02)
  Top 0.2: C20.1 15.75,8.79 U4.P$17 | v4.55,4.3 PROG.1 | C20.1 15.1,8.04 15.15,8.04 | LED1.A v4.9,9.5 | AUX.3 19.45,5.35 19.5,5.3 19.5,5 19.2,4.7 18.5,4.7 18.3,4.3 v18.3,4.2 | v15.8,8.1 15.7,8.21 C20.1 | C24.2 v26,12.4 25.3,13.1 U4.P$44 | C22.1 24.8,8.65 v24.6,8.95 24.1,9.5 U4.P$35 | v18.4,7.8 18.45,7.75 C21.1 18.9,8.24 U4.P$24 | U1.P$1 27.32,21.29 C2.1 | U4.P$67 C28.2 | U4.P$52 v22.9,17.65 | C27.1 19.05,18.25 20.1,17.2 U4.P$59
  Top 0.254: 27.6,20.7 C2.1 TPD.P$1 | C25.1 23.1,18.45 | C28.2 17.2,18.6 v17.8,18.6 | C29.1 4.55,6.3 PROG.1
  Top 0.3: v19.05,19.5 C27.1
  Top 0.305: 23.1,18.45 arc90 22.9,18.25 v22.9,17.65
  Top 0.406: C2.1 27.7,19.7 v25,16.8
  Bottom 0.2: 22.45,2.8 arc-90 R31.2
  Bottom 0.254: 22.45,2.8 21.5,2.8 v21.3,3 | U8.7 26.8,9.63 | R32.2 R31.2 | 26.8,12.67 v26.8,12.7 | U8.8 26.79,14.99 27.6,15.8 30,15.8 30.6,15.2 U8.11
  Bottom 0.3: U8.8 26.8,12.67
  Bottom 0.305: U8.7 v26.79,12.69 v26.8,12.7
  Bottom 0.406: SJ3.2 16.4,17.9 v15.9,18.4
  pour Route15: 26.3,27.8 26.3,16.6 27.1,15.8 27.1,7.6 26.7,7 26.7,0 3.5,0 3.5,27.8
GND  (via drill 0.3, 0.4, 0.6, 0.7)  (2 unrouted)
  Top 0.127: v44.85,17.65 45.35,17.15 45.35,15 | 45.35,15 45.35,14.3 | 45.35,14.3 45.35,10.9 44.95,10.5 44.5,10.5 | H10.13 45.35,15 | H10.14 46.04,14.3 45.35,14.3 | 46.1,13.7 45.4,13.7 | H10.16 45.4,13.1
  Top 0.2: v5.6,4.3 5.05,4.85 PROG.2 | 4.95,6.8 C29.2 | C20.2 14,8.14 v13.05,8.15 | RGB1.P$1 v2.5,14.6 | 19.95,5.25 AUX.4 19.95,4.65 v19.25,3.95 | H10.13 H10.14 H10.15 46.1,13.7 H10.16 | C22.2 v24.8,6.2 | C26A.1 19.95,6.96 | U1.P$3 26.8,23.2 U1.P$7 | U4.P$25 19.3,11.1 U4.P$69 | 17.2,14.3 U4.P$5 15.1,14.3 | U4.P$7 17.1,13.5 | 17.1,13.5 17.3,13.5 | 17.1,13.1 U4.P$8 15.1,13.1 | 17.1,13.1 17.1,12.7 U4.P$9 15.1,12.7 | 17.1,13.1 17.1,13.5 | 21.9,13.5 22.2,13.5 22.2,12.7 | 15.7,13.5 15.1,13.5 | v24.9,12.5 24.7,12.7 U4.P$43 | 20.5,14.7 U4.P$58 20.5,18.5 | v6.3,18.7 7.5,18.7 8.3,19.5 12.5,19.5 v13.6,18.4 | U4.P$45 25.8,13.5 v26,13.3
  Top 0.25: 26.8,21.41 U1.P$7 | 15.1,14.3 15.1,13.5 15.1,13.4 15.1,13.1 15.1,12.7
  Top 0.254: 26.8,21.41 C2.2 26.2,20.61 | C1.2 24.9,23.71 | C28.1 v17.8,19.5 | C25.2 24,18.45 v24,17.4 | v44.2,2.2 44.2,2.1 | Q2.E 9.04,13.5 v7.8,13.5 | R24.1 v13.05,8.15 | v31,12.5 31.21,12.5 U6.30 U6.29 | U6.17 36,17.98 36,16.58 | 36,16.58 36,16.1 36.7,15.4 U6.CNTR | v38.65,16.45 38.7,16.45 U6.8 37.92,15.68 | 37.92,15.68 37.7,15.45 37.7,15.3 38.96,15.3 | U6.12 36.66,17.24 | U6.11 37.02,16.9 | 37.02,16.9 37,16.9 36.66,17.24 | U6.10 37.4,16.57 | 37.4,16.57 37.4,16.4 37.92,15.88 37.92,15.68 | 37.02,16.9 37.36,16.57 37.4,16.57 | 36.66,17.24 36,16.58 | U6.6 38.96,15.3 | U6.4 39.58,14.5 38.9,14.5 | 38.9,14.5 38.96,14.56 38.96,15.3 | U6.2 40.7,14.21 v40.7,14.1 | U6.56 41.3,14.1 v40.7,14.1 | U6.54 39.98,14 39.7,14 39.8,14.1 v40.7,14.1 | U6.52 38.9,13.67 | 38.9,13.67 38.9,14.5 | U6.50 38.1,13.05 | 38.1,13.05 38.1,13.4 38.37,13.67 38.9,13.67 | U6.48 37.5,12.24 | 37.5,12.24 37.5,12.3 38.1,12.9 38.1,13.05 | U6.46 36.9,11.43 36.9,11.6 37.5,12.2 37.5,12.24 | U6.44 v36.81,10.1 v36.8,10.1 36.8,11.6 36.7,11.7 | v34.45,16.15 35,15.6 | 35,15.6 34.8,13.9 34.8,13.26 U6.34 U6.35 | U6.32 34,13.88 34,13.9 35,15.6 | U6.35 | U6.35 U6.36 U6.37 | U6.37 | U6.37 U6.38 U6.39 U6.40 U6.41 U6.42 | 4.95,6.8 5.05,6.7 PROG.2 | 20.5,18.5 20.5,19.2 v20.2,19.5 | C42.2 | C42.2 v39.75,18.75
  Top 0.3: C27.2 20.5,18.5 C26.2 | C3.2 28.5,25.1 v29.1,25.7 29.8,25 C4.2 | v14.5,13.4 15.1,13.4 | v25.5,9.8 25.5,10.65
  Top 0.305: C21.2 C26A.1 | 19.95,6.96 AUX.4 | C41.2 C40.2 29.89,15.88 v30.5,16.5
  Top 0.406: 26.2,20.61 v26.2,19.5 | C23.2 25.5,10.65 C24.1
  Top 0.5: 24.9,23.71 v24.9,25.1
  Route15 0.254: v32.51,3 32.51,5.09 v32.5,5.8
  Bottom 0.178: 14.2,23.2 13.7,22.7 U2.A2
  Bottom 0.2: U9.8 38.77,6.37 v38.8,6.4 39.2,7.1 40.1,7.1 40.27,6.93 U9.10 | U5.28 19.5,5.3 19.3,5.1 19.3,4.1 v19.25,3.95
  Bottom 0.254: C5.2 14.2,24.41 14.2,23.2 | U7.4 U7.3 32.47,2.96 v32.51,3 | U9.2 40.9,2.64 40.9,2.1 40.4,1.6 v39.9,1.6 39.63,1.86 U9.4 | C50.2 37.65,5.46 U9.8 | C51.2 v44.2,2.2 | U7.12 32.47,6.37 v32.5,5.8
  Bottom 0.3: U3.P$5 20.2,21.61 v20.2,20.8 | U5.29 19.7,11.5 18.1,13.4
  Bottom 0.305: 18.1,13.4 18.1,15 U5.12 | C15.2 21.4,19.55 C14.2
  Bottom 0.406: v14,26 C5.2 | v2.5,14.6 4.1,14.6 U5.1 | BAT.5 v7,23.3 | v13.6,18.4 C31.1 12.5,16.99 C30.1 | v8.6,20.2 8.9,20.5 C6.2 C7.2 | 21.4,19.55 22.3,19.55 v22.4,19.5 | v18.1,17.6 18.1,15
  other vias: 44.45,10.45
  pour Route2: 0.2,0.2 47.8,0.2 47.8,27.9 0.2,27.8
IDAC_SINK  (via drill 0.3)
  Top 0.2: U4.P$30 21.3,8.1 21.5,7.9 22,7.9 v22.1,7.8
  Bottom 0.254: v22.1,7.8 22.45,8.1 27.3,8.15 28.06,8.86 U8.6
  Bottom 0.305: U8.5 U8.6 U8.9
IDAC_SOURCE  (via drill 0.3)
  Top 0.2: U4.P$29 20.9,7.8 21.4,7.3 21.8,7.3 v22.1,6.9
  Route15 0.254: v33.8,5.7 v33.8,3
  Bottom 0.178: 33.77,2.98 v33.8,3 | 33.77,5.72 v33.8,5.7
  Bottom 0.254: U7.1 U7.2 33.74,1.71 33.77,1.71 33.77,2.98 | v22.1,6.9 25.6,3.7 33.1,3.7 v33.8,3 | v33.8,5.7 33.74,5.76 U7.13
ISTIM+  (via drill 0.3)
  Route15 0.254: v42.3,6.3 41.6,5.6 v41.6,1.5
  Bottom 0.2: U9.12 41.59,6.3 v42.3,6.3
  Bottom 0.254: U7.5 29.86,1.33 30.3,0.7 40.9,0.7 v41.6,1.5 41.6,2.64 U9.1 | U9.12 41.56,6.37
ISTIM-  (via drill 0.3)
  Top 0.254: v40.9,7.3 40.9,4.86 42.43,2.83 42.47,2.83 v42.5,2.8
  Bottom 0.254: v42.5,2.8 42.47,3.44 U9.16 | 40.7,7.5 arc-90 v40.9,7.3 | v40.9,7.3 40.9,6.36 U9.11 | U8.1 39.02,9.18 v40.9,7.3
LED_B
  Top 0.2: R22.1 6.6,15 9.4,18.2 11.1,18.2 13.8,15.5 U4.P$2
LED_G
  Top 0.2: R20.1 7,17.4 8.5,19 11.7,19 14.05,16.65 U4.P$68
LED_R
  Top 0.2: R21.1 6.8,16.2 9,18.6 11.4,18.6 14.1,15.9 U4.P$1
MISO
  Top 0.2: U4.P$48 26.5,14.7 29.5,17.6 30.73,17.6 U6.25
MOSI
  Top 0.2: U4.P$49 26.3,15.1 29.4,18.2 31.54,18.2 U6.23
N$2
  Top 0.254: C41.1 31.06,14.19 U6.28
N$3
  Top 0.2: RGB1.P$2 2.5,17.4 3.3,16.5 4.64,16.5 R21.2
N$4
  Bottom 0.178: 13.2,23.79 U2.B3 | U2.A3 13.6,23.79
  Bottom 0.254: C5.1 13.2,23.79 13.6,23.79
  Bottom 0.406: C5.1 10.9,24.89 SJ1.1
N$5
  Top 0.2: RGB1.P$3 5.02,17.38 R20.2
N$6
  Bottom 0.2: U9.13 43.76,6.8
  Bottom 0.406: C52.1 43.76,6.8
N$7
  Top 0.2: RGB1.P$4 4.22,15 R22.2
N$8
  Top 0.2: R30.2 2.04,9.29 LED1.C
N$9
  Bottom 0.305: 14.81,16.6 C30.2 14.7,16.79
  Bottom 0.406: 14.81,16.6 SJ3.1 16.9,16.1 U5.11 | C31.2 14.7,16.79
N$10
  Top 0.3: R23.1 Q2.C 10,14.46 Q1.C
N$11  (via drill 0.3)
  Route15 0.254: v28.7,5.8 v28.7,3
  Bottom 0.178: U7.9 U7.10 30,7.44 | v28.7,5.8 | 28.7,3.1 v28.7,3
  Bottom 0.254: U7.9 28.7,7.12 v28.7,5.8 | U7.6 28.7,1.68 v28.7,3 | U7.10 30,7.12 30,6.2 31.2,5 34.4,5 35,5.6 U7.14
N$12
  Top 0.305: SW1.3 SW1.1 11.05,7.25 R24.2
N$13
  Bottom 0.3: U3.P$6 19.57,22.68 C12.1
  Bottom 0.305: C13.1 C12.1
  Bottom 0.4: SJ2.2 16.7,21.21 C13.1
N$16
  Bottom 0.254: SJ4.2 23.89,1.84 R32.1
N$17
  Bottom 0.254: U9.15 42.6,4.1 45.1,4.1 46.1,5 C53.1
N$19
  Top 0.2: 13.3,3.4 14.2,3.4
N$30
  Top 0.2: C23.1 24.25,12.3 U4.P$42
N$31  (via drill 0.3)
  Route15 0.254: v29.4,13.2 29.4,12.8 30.7,11.5 32.54,11.5 33.14,10.9 33.14,10.44 v33.1,10.4
  Bottom 0.254: U8.13 U8.14 | v29.4,13.2 29.4,14.55 U8.10
  Bottom 0.305: U8.13 33.14,10.44 v33.1,10.4 33.1,9.22 U8.2
N$33
  Bottom 0.2: U2.A1 14,21.95 C8.1
N$36
  Bottom 0.178: U2.C3 12.35,23.1
  Bottom 0.254: 12.35,23.1 C9.2
N$42
  Bottom 0.254: C11.1 25.52,22.68 U3.P$3
N$46
  Bottom 0.254: C11.2 25.52,23.32 U3.P$2
N$47
  Bottom 0.3: C10.1 21.4,24.75 U3.P$8
N$48
  Bottom 0.3: C10.2 23.6,24.75 U3.P$1
N$49
  Bottom 0.2: U2.B1 13.2,21.66 C8.2
N$50
  Bottom 0.2: U2.C2 11.95,22.7 C9.1
PIO3  (via drill 0.3)
  Route15 0.2: 21.4,2 v21.3,2 12,2 11.2,2.9 v11.3,3
  Bottom 0.2: 22.16,1.8 R31.1
  Bottom 0.254: 9.4,1.9 U5.20 9.7,2.7 10,3 v11.3,3 | 22.16,1.8 21.5,1.8 v21.3,2
PIO4  (via drill 0.3)
  Route15 0.2: v26.1,2.3 25.5,1.4 7.7,1.4 v6.6,2.9
  Bottom 0.254: v26.1,2.3 SJ4.1 | U5.22 7.3,2.2 v6.6,2.9
PIO5  (via drill 0.4)
  Top 0.2: v7.4,3.5 4.2,3.5 3.7,4 3.7,6.25 R30.1
  Bottom 0.254: U5.21 8.5,2.4 v7.4,3.5
RN_RESET  (via drill 0.3)
  Top 0.2: v13.9,10.9 14.1,11.1 U4.P$13
  Bottom 0.254: U5.5 9.7,14.3 10.2,13.8 12.2,13.8 13.9,12.1 v13.9,10.9
SCLK
  Top 0.2: U4.P$50 26.1,15.5 29.2,18.6 32.55,18.6 U6.21
SS
  Top 0.2: U4.P$51 25.9,15.9 29,19 33.57,19 U6.19
STIME1  (via drill 0.3)
  Top 0.254: H10.11 46.1,17 v45.9,17.4
  Bottom 0.254: v45.9,17.4 45.9,10.9 C52.2
STIME2  (via drill 0.3)
  Top 0.127: H10.12 46.07,15.6
  Top 0.254: H10.12 46.63,15.63 46.9,15.9 46.9,17 v46.7,17.1
  Bottom 0.254: C53.2 46.7,9.1 v46.7,17.1
STIMSEL0  (via drill 0.3)
  Top 0.2: 26.8,13.9 U4.P$46
  Top 0.254: v35.7,4.9 32.6,8 26.8,13.9
  Bottom 0.2: v35.7,4.9 35.77,4.83 U9.7
STIMSEL1  (via drill 0.3)
  Top 0.2: 38.4,3.1 v38.4,2.8 | 27.2,14.3 U4.P$47
  Top 0.254: 27.2,14.3 38.4,3.1
  Bottom 0.254: U9.5 38.44,3.54 v38.4,2.8
SWDCK  (via drill 0.3)
  Top 0.2: v12.6,10.8 13.3,11.5 U4.P$12 | PROG.5 6.55,5.95 7.2,6.6 v7.7,6.6
  Bottom 0.2: v7.7,6.6 11.9,10.8 v12.6,10.8
SWDIO  (via drill 0.3)
  Top 0.2: v12.6,11.7 12.8,11.9 U4.P$11 | PROG.4 6.05,6.25 v6.9,7.1
  Bottom 0.2: v6.9,7.1 11.5,11.7 v12.6,11.7
SWV  (via drill 0.3)
  Top 0.2: v12.6,9.9 13.2,10.3 14.1,10.3 14.7,10.7 U4.P$14 | v7.7,5.5 PROG.6
  Bottom 0.2: v7.7,5.5 12,9.9 v12.6,9.9
SYNC
  Top 0.2: R23.2 13.3,13.54 13.3,14.4 14,15.1 U4.P$3
UART_CTS  (via drill 0.3)
  Top 0.2: v13.3,3.4 13.3,4.9 16.5,7.9 U4.P$18
  Bottom 0.254: U5.16 14.5,2 13.3,3.2 v13.3,3.4
UART_RTS  (via drill 0.3)
  Top 0.2: v14.2,3.4 14.2,5.2 16.9,7.7 U4.P$19
  Bottom 0.2: 15.4,1.9 U5.15
  Bottom 0.254: 15.4,1.9 15.4,3.1 15.1,3.4 v14.2,3.4
UART_RX  (via drill 0.3)
  Top 0.2: v13.7,9.2 14.7,9.2 15.3,9.9 U4.P$16
  Bottom 0.2: U5.14 16.9,3.2 13.7,6.6 v13.7,9.2
UART_TX  (via drill 0.3)
  Top 0.2: v14.4,9.8 14.9,10.3 U4.P$15
  Bottom 0.2: v14.4,9.8 14.4,6.8 18.1,2.8 U5.13
VBAT  (via drill 0.7)
  Top 0.7: D2.A v7,21.6
  Bottom 0.406: BAT.1 6.1,20.7 v7,21.6
VCCD  (via drill 0.3)
  Top 0.178: 19.7,9.3 19.8,9.4
  Top 0.2: C26.1 21.95,17.8 v21.7,17.5 21.15,17.5 20.9,17.25 U4.P$57 20.9,16 21,15.9 22.8,15.9 22.9,15.8 22.9,9.6 22.7,9.4 19.8,9.4 | C26A.2 19.8,8.2 19.7,8.3 U4.P$26 19.7,9.3
VIN  (via drill 0.6 pad 1.02)
  Top 0.2: 25.21,22.4 U1.P$6 U1.P$5 U1.P$4
  Top 0.254: C1.1 25.21,22.4
  Top 0.406: v9.4,23.2 10.3,23.2 11.4,22.1
  Top 0.5: C1.1 11.51,21.99 arc-90 11.4,22.1 D2.C
  Bottom 0.406: SJ1.2 9.4,24.91 v9.4,23.2
XRES
  Top 0.2: PROG.3 5.55,6.65 6.7,7.8 8.9,7.8 arc-90 SW1.2 SW1.4 10,12.3 U4.P$10

### Text on the board
tPlace: 3.4-5.1 / Volts | BT-STATUS | SRD | Rev-B
bPlace: FACTORY / RESET
tNames: RESET